# EAGLE design IRSensor (EAGLE 7.1.0)
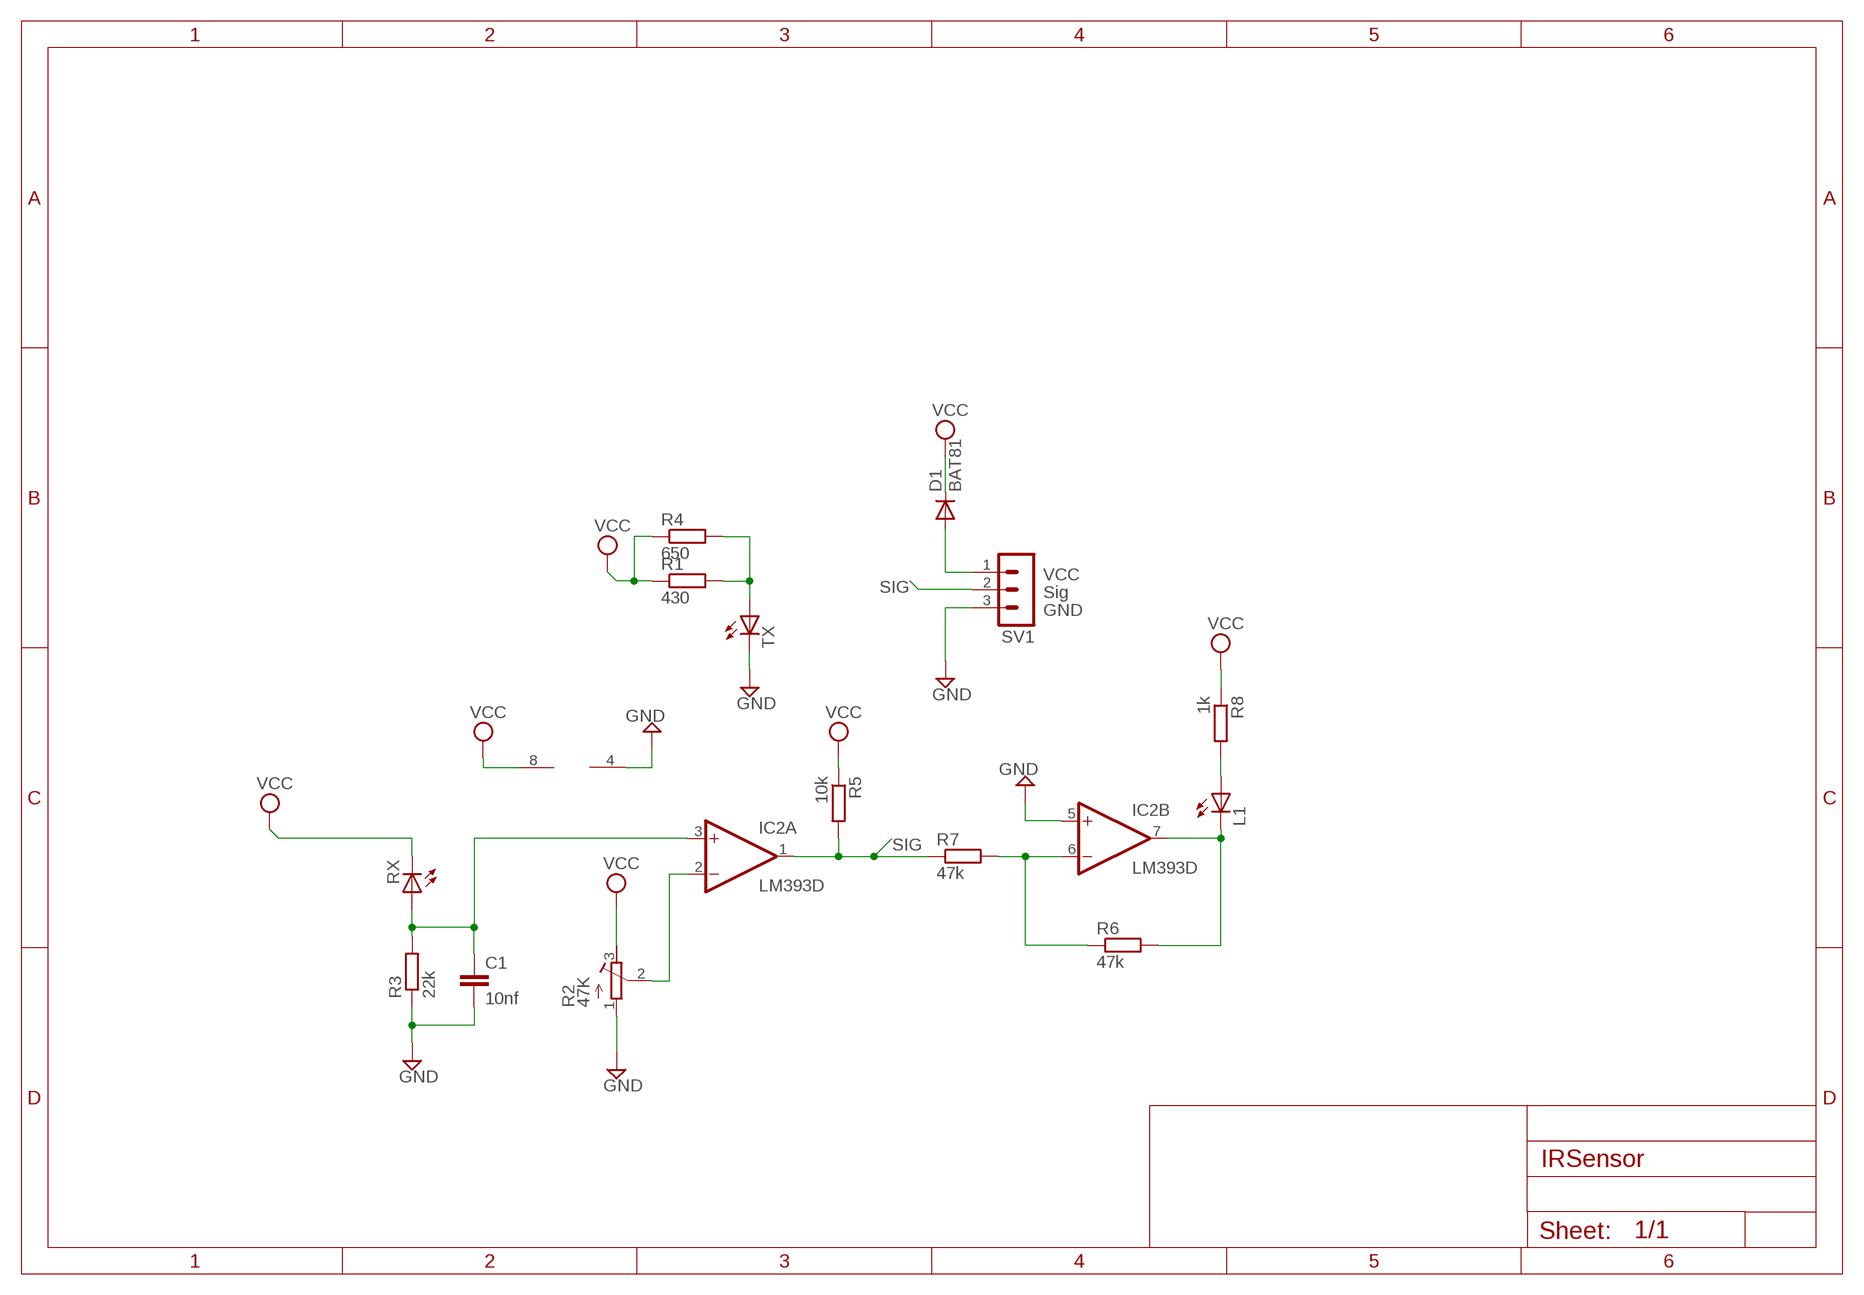
[diagram p0: schematic, sheet 1]

## Parts
C1  10nf  C-EUC1206  [C1206]
D1  BAT81  [DO34-7]
IC2  LM393D  [SO08]
L1  LEDCHIPLED_0805  [CHIPLED_0805]
R1  430  R-EU_0204/7  [0204/7]
R2  47K  R-TRIMM64W  [RTRIM64W]
R3  22k  R-EU_M1206  [M1206]
R4  650  R-EU_0204/7  [0204/7]
R5  10k  R-EU_M1206  [M1206]
R6  47k  R-EU_M1206  [M1206]
R7  47k  R-EU_M1206  [M1206]
R8  1k  R-EU_M1206  [M1206]
RX  LED3MM  [LED3MM]
SV1  MA03-1  [MA03-1]
TX  LED3MM  [LED3MM]

## Nets
GND: C1.2 IC2.4(P:V-) IC2.5(B:+IN) R2.1(E) R3.1 SV1.3 TX.K(C)
N$1: R1.2 R4.2 TX.A
N$2: D1.A SV1.1
N$3: L1.A R8.2
N$4: IC2.7(B:OUT) L1.C R6.2
N$5: C1.1 IC2.3(A:+IN) R3.2 RX.A
N$6: IC2.6(B:-IN) R6.1 R7.2
N$8: IC2.2(A:-IN) R2.2(S)
SIG: IC2.1(A:OUT) R5.2 R7.1 SV1.2
VCC: D1.C IC2.8(P:V+) R1.1 R2.3(A) R4.1 R5.1 R8.1 RX.K(C)

## Notes on the sheet
- VCC
- Sig
- GND

## Library data of the parts
C1 = rcl:C-EU: CAPACITOR, European symbol
D1 = diode-1:BAT81: DIODE barrier diode
IC2 = linear:LM393: COMPARATOR
L1 RX TX = led:LED: LED OSRAM: - CHIPLED LG R971, LG N971, LY N971, LG Q971, LY Q971, LO R971, LY R971 LH N974, LH R974 LS Q976, LO Q976, LY Q976 LO Q996 - Hyper CHIPLED LW Q18S LB Q993, LB Q99A, LB R99A - SideLED LS A670, LO A670, LY A670, LG A670, LP A670 LB A673, LV A673, LT A673, LW A673 LH A674 LY A675 LS A676, LA A676, LO A676, LY A676, LW A676 LS A679, LY A679, LG A679 - Hyper Micro SIDELED® LS Y876, LA Y876, LO Y876, LY Y876 LT Y87S - SmartLED LW L88C, LW L88S LB L89C, LB L89S, LG L890 LS L89K, LO L89K, LY L89K LS L896, LA L896, LO L896, LY L896 - TOPLED LS T670, LO T670, LY T670, LG T670, LP T670 LSG T670, LSP T670, LSY T670, LOP T670, LYG T670 LG T671, LOG T671, LSG T671 LB T673, LV T673, LT T673, LW T673 LH T674 LS T676, LA T676, LO T676, LY T676, LB T676, LH T676, LSB T676, LW T676 LB T67C, LV T67C, LT T67C, LS T67K, LO T67K, LY T67K, LW E67C LS E67B, LA E67B, LO E67B, LY E67B, LB E67C, LV E67C, LT E67C LW T67C LS T679, LY T679, LG T679 LS T770, LO T770, LY T770, LG T770, LP T770 LB T773, LV T773, LT T773, LW T773 LH T774 LS E675, LA E675, LY E675, LS T675 LS T776, LA T776, LO T776, LY T776, LB T776 LHGB T686 LT T68C, LB T68C - Hyper Mini TOPLED® LB M676 - Mini TOPLED Santana® LG M470 LS M47K, LO M47K, LY M47K Source: http://www.osram.convergy.de LUXEON: - LUMILED® LXK2-PW12-R00, LXK2-PW12-S00, LXK2-PW14-U00, LXK2-PW14-V00 LXK2-PM12-R00, LXK2-PM12-S00, LXK2-PM14-U00 LXK2-PE12-Q00, LXK2-PE12-R00, LXK2-PE12-S00, LXK2-PE14-T00, LXK2-PE14-U00 LXK2-PB12-K00, LXK2-PB12-L00, LXK2-PB12-M00, LXK2-PB14-N00, LXK2-PB14-P00, LXK2-PB14-Q00 LXK2-PR12-L00, LXK2-PR12-M00, LXK2-PR14-Q00, LXK2-PR14-R00 LXK2-PD12-Q00, LXK2-PD12-R00, LXK2-PD12-S00 LXK2-PH12-R00, LXK2-PH12-S00 LXK2-PL12-P00, LXK2-PL12-Q00, LXK2-PL12-R00 Source: www.luxeon.com KINGBRIGHT: KA-3528ASYC Source: www.kingbright.com
R1 R3-R8 = rcl:R-EU_: RESISTOR, European symbol
R2 = rcl:R-TRIMM: Trimm resistor
SV1 = con-lstb:MA03-1: PIN HEADER

## Net classes
0 default: width 0.356 mm, drill 0.762 mm, clearance 0.356 mm

## Board
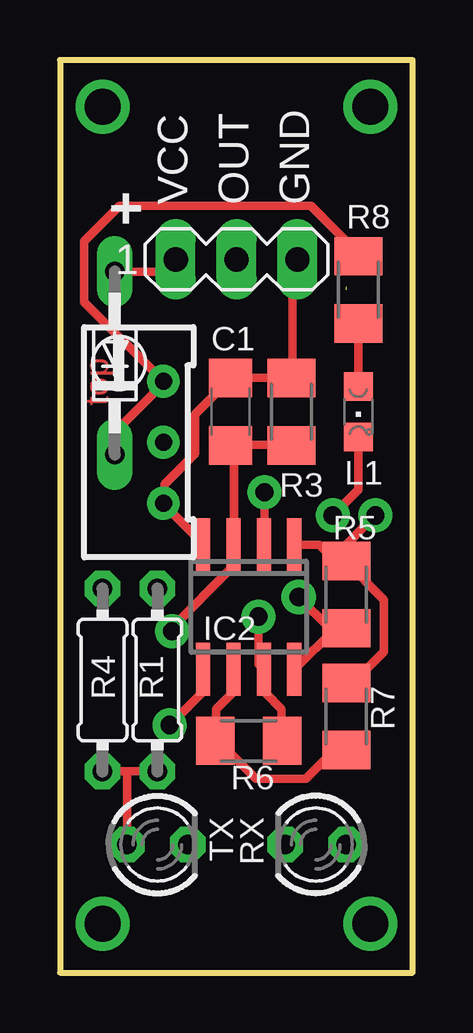
[diagram p1: board, top side]
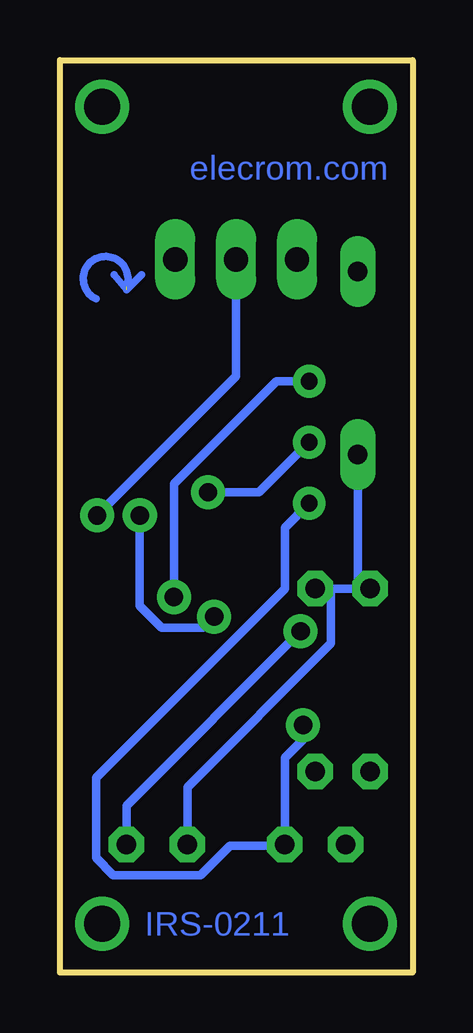
[diagram p2: board, bottom side, seen from below]

Size 14.71 x 38.02 mm. Coordinates in mm from the lower left corner, seen from the top.
Outline: 0,0 14.71,0 14.71,38.02 0,38.02 0,0
Copper layers (1*16): Top 0.035mm / dielectric 1.5mm / Bottom 0.035mm
Design rules "default *": minimum track width 10mil, minimum drill 30mil, track to track 12mil, track to pad 12mil, pad to pad 10mil, via to via 14mil, smd to smd 0mil, copper to edge 30mil, drill to drill 8mil, minimum pad ring 13mil, minimum via ring 13mil, stop-mask expansion 4mil, vias tented up to drill 0mil, thermal gap 10mil

### Footprints (pad centres in the part's own frame; a part is rotated, then mirrored left to right if it is on the bottom)
C1206 = smd 1.6 x 1.8: 1 -1.4,0; 2 1.4,0
DO34-7 = drill 0.813 long: A 3.81,0; C -3.81,0
SO08 = smd 0.6 x 2.2: 1 -1.905,-2.6; 2 -0.635,-2.6; 3 0.635,-2.6; 4 1.905,-2.6; 5 1.905,2.6; 6 0.635,2.6; 7 -0.635,2.6; 8 -1.905,2.6
CHIPLED_0805 = smd 1.2 x 1.2: A 0,-1.05; C 0,1.05
0204/7 = drill 0.813 octagon: 1 -3.81,0; 2 3.81,0
RTRIM64W = drill 0.7: 1 1.27,-2.54; 2 1.27,0; 3 1.27,2.54
M1206 = smd 1.6 x 2: 1 -1.4,0; 2 1.4,0
LED3MM = drill 0.813 octagon: A -1.27,0; K 1.27,0
MA03-1 = drill 1.016 long: 1 -2.54,0; 2 0,0; 3 2.54,0

### Placement (x,y rotation side)
C1  7.11,23.37 90 top
D1  2.29,25.4 90 top
IC2  7.87,15.24 180 top
L1  12.45,23.37 180 top
R1  4.06,12.19 270 top
R2  3.05,22.1 0 top
R3  9.65,23.37 270 top
R4  1.78,12.19 270 top
R5  11.94,15.75 90 top
R6  7.87,9.65 0 top
R7  11.94,10.67 270 top
R8  12.45,28.45 270 top
RX  10.67,5.33 180 top
SV1  7.37,29.72 0 top
TX  4.06,5.33 0 top

### Tracks (layer width: path | path; a pad name or v marks a point on that pad's centre or on a via)
ARROW  (1 unrouted)
  Bottom 0.305: 11.94,28.57 arc-265 13.21,28.07 | 11.3,29.08 11.94,28.45 12.45,29.08
GND  (via drill 0.76)
  Top 0.356: v4.57,10.31 5.94,11.68 5.94,12.6 IC2.5 | IC2.4 5.94,17.88 4.32,19.51 R2.1 4.37,19.71 4.37,20.34 5.64,21.61 5.64,23.27 7.01,24.64 C1.2 7.11,24.79 9.65,24.79 R3.1 9.7,24.94 9.7,29.52 SV1.3
  Bottom 0.356: v4.57,10.31 4.57,9.7 5.33,8.94 TX.K 5.49,5.28 7.62,5.28 8.84,4.06 12.5,4.06 13.21,4.78 13.21,8.13 5.33,16 5.33,18.54 R2.1
N$1
  Top 0.356: 2.79,8.38 R1.2 | R4.2 2.79,8.38 | 2.79,8.38 TX.A
N$2
  Top 0.356: D1.A 4.32,29.21 SV1.1
N$3
  Top 0.356: L1.A R8.2
N$4  (via drill 0.76)
  Top 0.356: v11.38,19.05 12.45,20.12 L1.C | v8.28,14.83 8.28,12.85 8.48,12.65 IC2.7 8.59,12.5 8.59,11.63 9.25,10.97 9.25,9.65 R6.2
  Bottom 0.356: v11.38,19.05 11.38,15.29 10.46,14.38 8.74,14.38 v8.28,14.83
N$5  (via drill 0.76)
  Top 0.356: R3.2 9.65,22 7.11,22 C1.1 7.26,21.84 7.26,17.88 IC2.3 7.16,17.68 7.16,16.87 4.67,14.38 v4.67,14.22
  Bottom 0.356: RX.A 11.94,6.96 v4.67,14.22
N$6
  Top 0.356: IC2.6 7.21,12.6 7.21,11.68 6.5,10.97 6.5,9.65 R6.1 6.66,9.6 8.18,8.08 10.26,8.08 11.43,9.25 11.94,9.25 R7.2
N$7  (via drill 1.5 pad 1.27)
  other vias: 12.95,36.07
N$8  (via drill 0.76)
  Top 0.356: v8.53,20.02 8.53,17.88 IC2.2
  Bottom 0.356: v8.53,20.02 6.4,20.02 R2.2
N$9  (via drill 1.5 pad 1.27)
  other vias: 1.78,2.03
N$10  (via drill 1.5 pad 1.27)
  other vias: 1.78,36.07
N$11  (via drill 1.5 pad 1.27)
  other vias: 12.95,2.03
SIG  (via drill 0.76)
  Top 0.356: R7.1 11.94,12.09 12.24,12.09 13.51,13.36 13.51,15.54 11.94,17.12 R5.2 | IC2.1 9.8,17.83 10.82,17.83 11.43,17.22 11.79,17.22 R5.2 | v13.16,19.05 11.48,17.37 R5.2
  Bottom 0.356: SV1.2 7.37,24.84 v13.16,19.05
VCC  (via drill 0.76)
  Top 0.356: IC2.8 9.8,12.65 11.48,14.33 11.94,14.33 R5.1 11.28,14.33 v9.96,15.65 | R8.1 12.45,29.97 10.46,31.95 2.49,31.95 1.02,30.48 1.02,27.94 R2.3 4.27,24.49 2.29,22.5 D1.C
  Bottom 0.356: RX.K 9.4,7.72 3.4,13.72 3.4,15.85 R1.1 R4.1 2.29,16.15 D1.C | v9.96,15.65 9.96,20.37 5.69,24.64 R2.3

### Text on the board
Top: top
Bottom: elecrom.com | IRS-0211
tPlace: VCC | OUT | GND | +